# Altium schematic sheet Sheet1.SchDoc
size A3; SheetNumber: 1; SheetTotal: 1
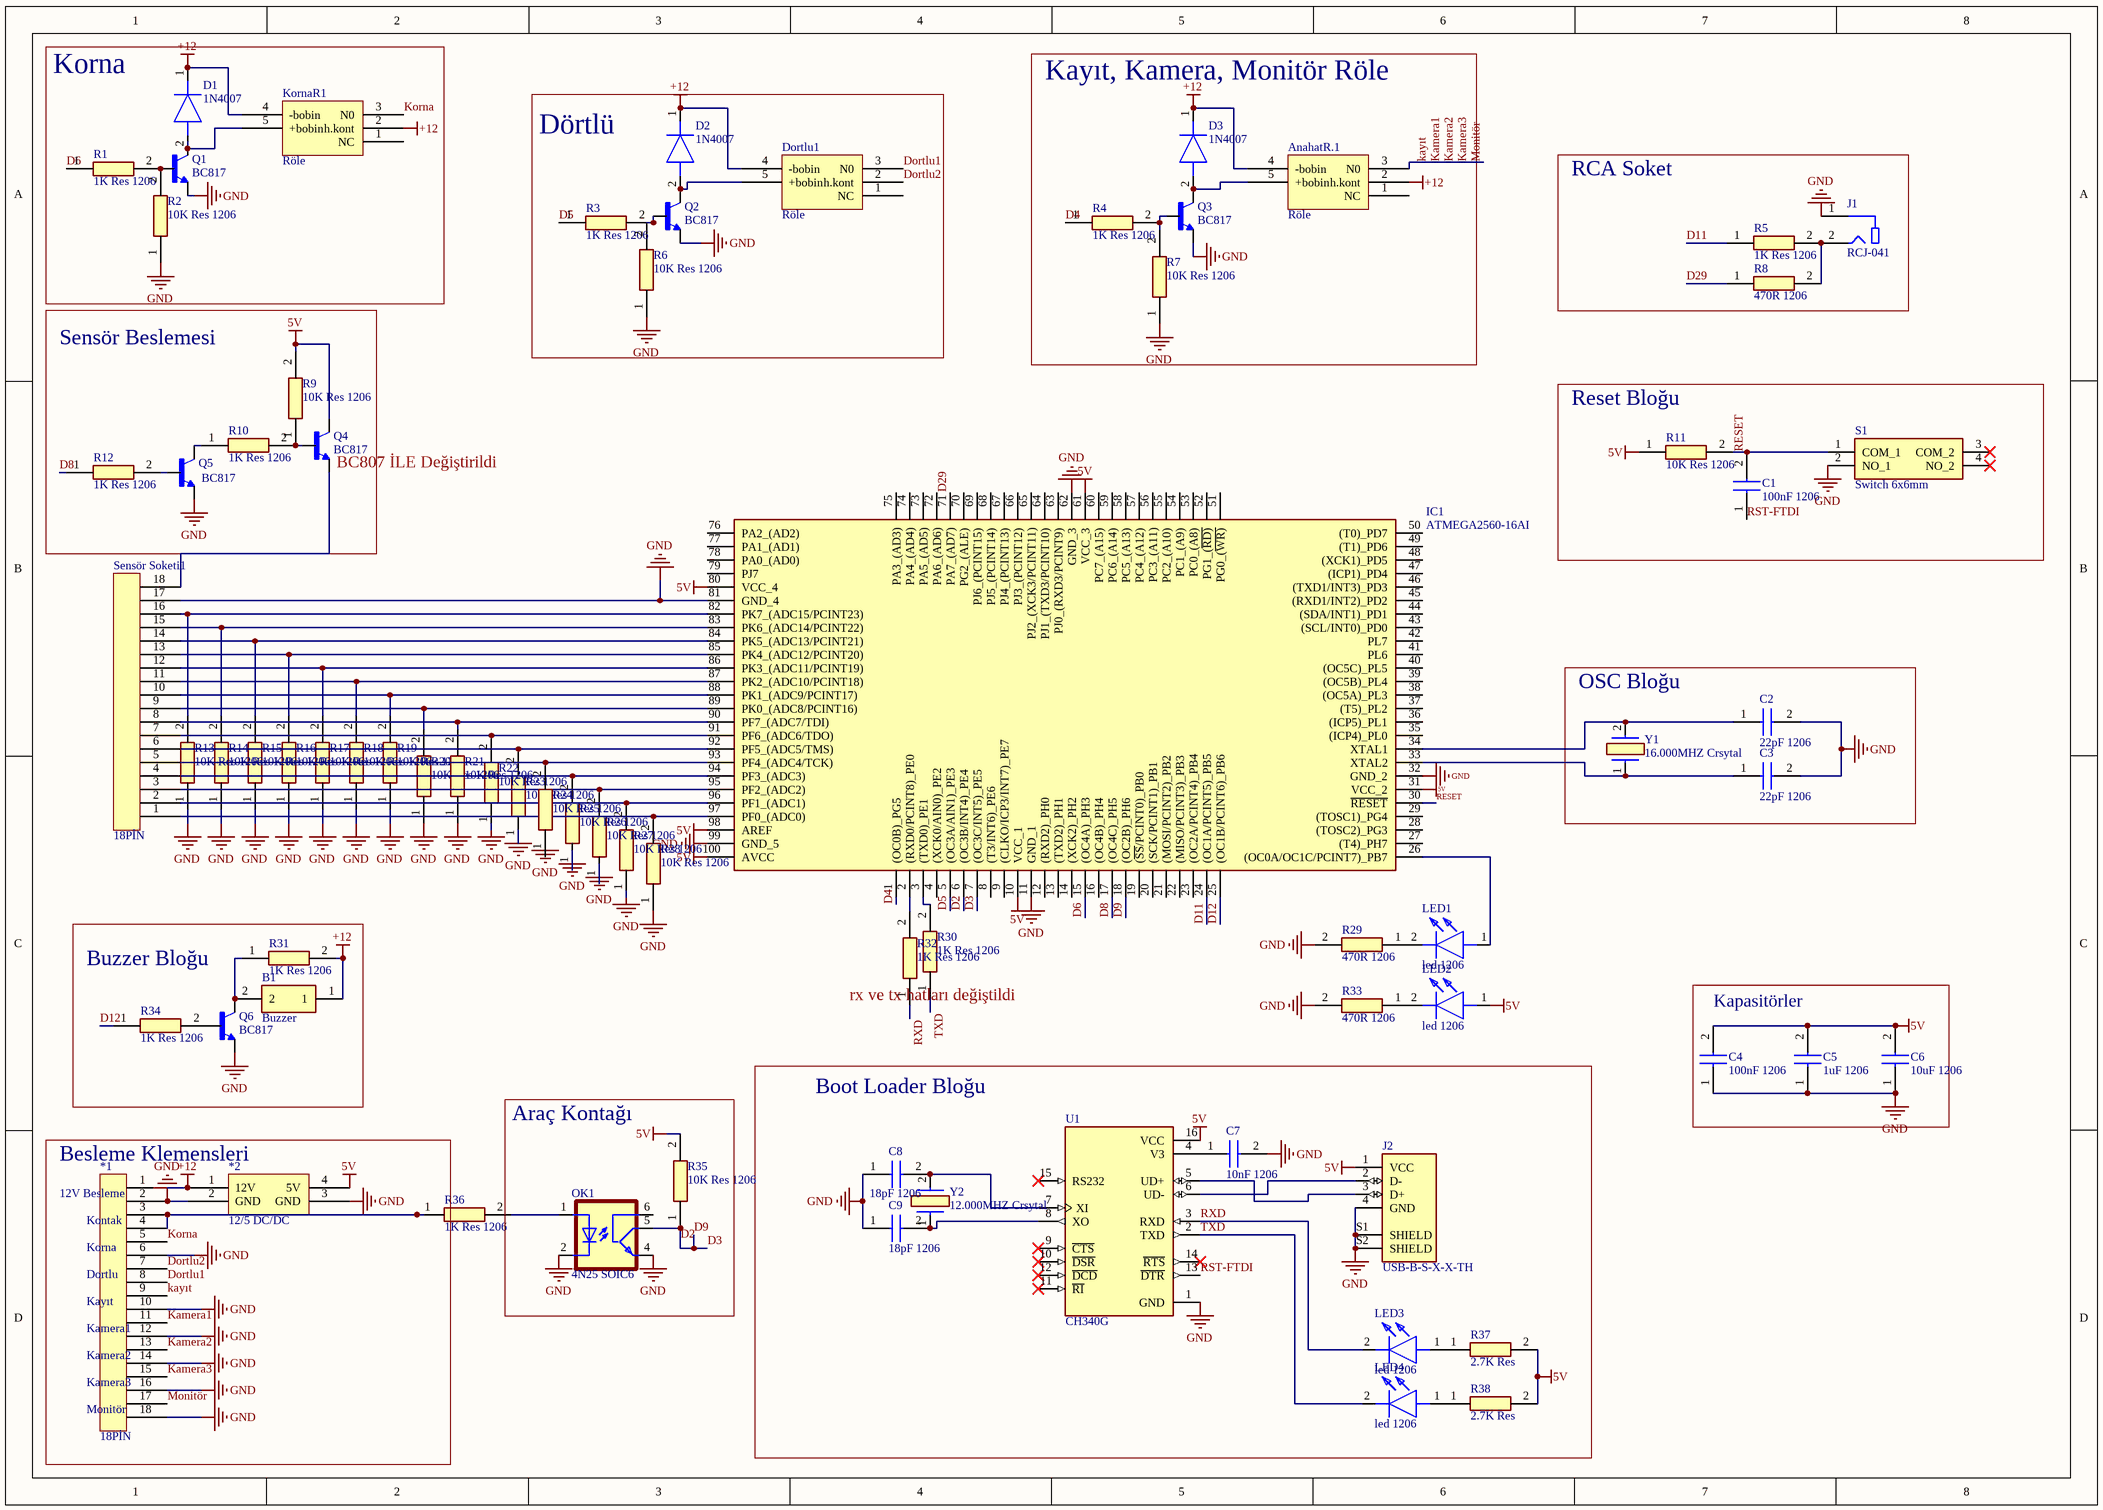
[diagram p0: Sheet1.SchDoc]

## Parts
*1  18PİN  [18x5,08]
*2  12/5 DC/DC  [12/5V DC/DC]
AnahatR.1  Röle  [Röle]
B1  Buzzer  [Buzzer]
C1  100nF 1206  [CAPC3216X95N(100nF 1206)]
C2  22pF 1206  [CAPC3216X95N(100nF 1206)]
C3  22pF 1206  [CAPC3216X95N(100nF 1206)]
C4  100nF 1206  [CAPC3216X95N(100nF 1206)]
C5  1uF 1206  [CAPC3216X95N(100nF 1206)]
C6  10uF 1206  [CAPC3216X95N(100nF 1206)]
C7  10nF 1206  [CAPC3216X95N(100nF 1206)]
C8  18pF 1206  [CAPC3216X95N(100nF 1206)]
C9  18pF 1206  [CAPC3216X95N(100nF 1206)]
D1  1N4007  [1N4007]
D2  1N4007  [1N4007]
D3  1N4007  [1N4007]
Dortlu1  Röle  [Röle]
IC1  ATMEGA2560-16AI  [QFP50P1600X1600X120-100N]
J1  RCJ-041  [RCA]
J2  USB-B-S-X-X-TH  [USB-B-S-X-X-TH]
KornaR1  Röle  [Röle]
LED1  led 1206  [led 1206]
LED2  led 1206  [led 1206]
LED3  led 1206  [led 1206]
LED4  led 1206  [led 1206]
OK1  4N25 SOIC6  [4N25 SOIC6]
Q1  BC817  [BC817 Sot23]
Q2  BC817  [BC817 Sot23]
Q3  BC817  [BC817 Sot23]
Q4  BC817  [BC817 Sot23]
Q5  BC817  [BC817 Sot23]
Q6  BC817  [BC817 Sot23]
R1  1K Res 1206  [RESC3216X60N ( 1206 )]
R2  10K Res 1206  [RESC3216X60N ( 1206 )]
R3  1K Res 1206  [RESC3216X60N ( 1206 )]
R4  1K Res 1206  [RESC3216X60N ( 1206 )]
R5  1K Res 1206  [RESC3216X60N ( 1206 )]
R6  10K Res 1206  [RESC3216X60N ( 1206 )]
R7  10K Res 1206  [RESC3216X60N ( 1206 )]
R8  470R 1206  [RESC3216X60N ( 1206 )]
R9  10K Res 1206  [RESC3216X60N ( 1206 )]
R10  1K Res 1206  [RESC3216X60N ( 1206 )]
R11  10K Res 1206  [RESC3216X60N ( 1206 )]
R12  1K Res 1206  [RESC3216X60N ( 1206 )]
R13  10K Res 1206  [RESC3216X60N ( 1206 )]
R14  10K Res 1206  [RESC3216X60N ( 1206 )]
R15  10K Res 1206  [RESC3216X60N ( 1206 )]
R16  10K Res 1206  [RESC3216X60N ( 1206 )]
R17  10K Res 1206  [RESC3216X60N ( 1206 )]
R18  10K Res 1206  [RESC3216X60N ( 1206 )]
R19  10K Res 1206  [RESC3216X60N ( 1206 )]
R20  10K Res 1206  [RESC3216X60N ( 1206 )]
R21  10K Res 1206  [RESC3216X60N ( 1206 )]
R22  10K Res 1206  [RESC3216X60N ( 1206 )]
R23  10K Res 1206  [RESC3216X60N ( 1206 )]
R24  10K Res 1206  [RESC3216X60N ( 1206 )]
R25  10K Res 1206  [RESC3216X60N ( 1206 )]
R26  10K Res 1206  [RESC3216X60N ( 1206 )]
R27  10K Res 1206  [RESC3216X60N ( 1206 )]
R28  10K Res 1206  [RESC3216X60N ( 1206 )]
R29  470R 1206  [RESC3216X60N ( 1206 )]
R30  1K Res 1206  [RESC3216X60N ( 1206 )]
R31  1K Res 1206  [RESC3216X60N ( 1206 )]
R32  1K Res 1206  [RESC3216X60N ( 1206 )]
R33  470R 1206  [RESC3216X60N ( 1206 )]
R34  1K Res 1206  [RESC3216X60N ( 1206 )]
R35  10K Res 1206  [RESC3216X60N ( 1206 )]
R36  1K Res 1206  [RESC3216X60N ( 1206 )]
R37  2.7K Res  [RESC3216X60N ( 1206 )]
R38  2.7K Res  [RESC3216X60N ( 1206 )]
S1  Switch 6x6mm  [6x6x8mm Push Buton]
Sensör_Soketi1  18PİN  [18x5,08]
U1  CH340G  [SOIC16]
Y1  16.000MHZ Crsytal  [XTAL_Dip]
Y2  12.000MHZ Crsytal  [XTAL_Dip]

## Blocks framed on the sheet
Korna: D1 KornaR1 Q1 R1 R2
Kayıt, Kamera, Monitör Röle: AnahatR.1 D3 Q3 R4 R7
Dörtlü: D2 Dortlu1 Q2 R3 R6
RCA Soket: J1 R5 R8
Sensör Beslemesi: Q4 Q5 R9 R10 R12
Reset Bloğu: C1 R11 S1
OSC Bloğu: C2 C3 Y1
Buzzer Bloğu: B1 Q6 R31 R34
Kapasitörler: C4-C6
Araç Kontağı: OK1 R35
Boot Loader Bloğu: C7-C9 J2 LED3 LED4 R37 R38 U1 Y2
Besleme Klemensleri: *1 *2

## Nets
5V: *2.4(5V) C4.2 C5.2 C6.2 IC1.10(VCC_1) IC1.31(VCC_2) IC1.61(VCC_3) IC1.80(VCC_4) IC1.98(AREF) IC1.100(AVCC) J2.1(VCC) LED2.1(A) Q4.3(C) R9.2 R11.1 R35.2 R37.2 R38.2 U1.16(VCC)
+12: *1.1 *2.1(12V) AnahatR.1.2(h.kont) AnahatR.1.4(-bobin) B1.1 D1.1(K) D2.1(K) D3.1(K) Dortlu1.4(-bobin) KornaR1.2(h.kont) KornaR1.4(-bobin) R31.2
GND: *1.2 *1.6 *1.10 *1.12 *1.14 *1.16 *1.18 *2.2(GND) *2.3(GND) C2.2 C3.2 C4.1 C5.1 C6.1 C7.2 C8.1 C9.1 IC1.11(GND_1) IC1.32(GND_2) IC1.62(GND_3) IC1.81(GND_4) IC1.99(GND_5) J1.1 J2.4(GND) J2.S1(SHIELD) J2.S2(SHIELD) OK1.2(C) OK1.4(EMI) Q1.2(E) Q2.2(E) Q3.2(E) Q5.2(E) Q6.2(E) R2.1 R6.1 R7.1 R13.1 R14.1 R15.1 R16.1 R17.1 R18.1 R19.1 R20.1 R21.1 R22.1 R23.1 R24.1 R25.1 R26.1 R27.1 R28.1 R29.2 R33.2 S1.2(NO_1) Sensör_Soketi1.17 U1.1(GND)
D2: IC1.6((OC3B/INT4)_PE4) IC1.7((OC3C/INT5)_PE5) IC1.18((OC2B)_PH6) OK1.5(COL) R35.1  [also labelled D3, D9]
D4: IC1.1((OC0B)_PG5) R4.1
D5: IC1.5((OC3A/AIN1)_PE3) R3.1
D6: IC1.15((OC4A)_PH3) R1.1
D8: IC1.17((OC4C)_PH5) R12.1
D11: IC1.24((OC1A/PCINT5)_PB5) R5.1
D12: IC1.25((OC1B/PCINT6)_PB6) R34.1
D29: IC1.71(PA7_(AD7)) R8.1
Dortlu1: *1.8 Dortlu1.3(N0)
Dortlu2: *1.7 Dortlu1.2(h.kont)
Kamera1: *1.9 *1.11 *1.13 *1.15 *1.17 AnahatR.1.3(N0)  [also labelled Kamera2, Kamera3, kayıt, Monitör]
Korna: *1.5 KornaR1.3(N0)
RESET: C1.2 IC1.30(~{RESET}) R11.2 S1.1(COM_1)
RST-FTDI: C1.1 U1.13(~{DTR})
RXD: LED3.2(K) R32.1 U1.3(RXD)
TXD: LED4.2(K) R30.1 U1.2(TXD)
Net*1_3: *1.3 *1.4 R36.1
NetAnahatR.1_5: AnahatR.1.5(+bobin) D3.2(A) Q3.3(C)
NetB1_2: B1.2 Q6.3(C) R31.1
NetC2_1: C2.1 IC1.34(XTAL1) Y1.2
NetC3_1: C3.1 IC1.33(XTAL2) Y1.1
NetC7_1: C7.1 U1.4(V3)
NetC8_2: C8.2 U1.7(XI) Y2.2
NetC9_2: C9.2 U1.8(XO) Y2.1
NetD1_2: D1.2(A) KornaR1.5(+bobin) Q1.3(C)
NetD2_2: D2.2(A) Dortlu1.5(+bobin) Q2.3(C)
NetIC1_2: IC1.2((RXD0/PCINT8)_PE0) R32.2
NetIC1_3: IC1.3((TXD0)_PE1) R30.2
NetIC1_26: IC1.26((OC0A/OC1C/PCINT7)_PB7) LED1.1(A)
NetIC1_82: IC1.82(PK7_(ADC15/PCINT23)) R13.2 Sensör_Soketi1.16
NetIC1_83: IC1.83(PK6_(ADC14/PCINT22)) R14.2 Sensör_Soketi1.15
NetIC1_84: IC1.84(PK5_(ADC13/PCINT21)) R15.2 Sensör_Soketi1.14
NetIC1_85: IC1.85(PK4_(ADC12/PCINT20)) R16.2 Sensör_Soketi1.13
NetIC1_86: IC1.86(PK3_(ADC11/PCINT19)) R17.2 Sensör_Soketi1.12
NetIC1_87: IC1.87(PK2_(ADC10/PCINT18)) R18.2 Sensör_Soketi1.11
NetIC1_88: IC1.88(PK1_(ADC9/PCINT17)) R19.2 Sensör_Soketi1.10
NetIC1_89: IC1.89(PK0_(ADC8/PCINT16)) R20.2 Sensör_Soketi1.9
NetIC1_90: IC1.90(PF7_(ADC7/TDI)) R21.2 Sensör_Soketi1.8
NetIC1_91: IC1.91(PF6_(ADC6/TDO)) R22.2 Sensör_Soketi1.7
NetIC1_92: IC1.92(PF5_(ADC5/TMS)) R23.2 Sensör_Soketi1.6
NetIC1_93: IC1.93(PF4_(ADC4/TCK)) R24.2 Sensör_Soketi1.5
NetIC1_94: IC1.94(PF3_(ADC3)) R25.2 Sensör_Soketi1.4
NetIC1_95: IC1.95(PF2_(ADC2)) R26.2 Sensör_Soketi1.3
NetIC1_96: IC1.96(PF1_(ADC1)) R27.2 Sensör_Soketi1.2
NetIC1_97: IC1.97(PF0_(ADC0)) R28.2 Sensör_Soketi1.1
NetJ1_2: J1.2 R5.2 R8.2
NetJ2_2: J2.2(D-) U1.6(UD-)
NetJ2_3: J2.3(D+) U1.5(UD+)
NetLED1_2: LED1.2(K) R29.1
NetLED2_2: LED2.2(K) R33.1
NetLED3_1: LED3.1(A) R37.1
NetLED4_1: LED4.1(A) R38.1
NetOK1_1: OK1.1(A) R36.2
NetQ1_1: Q1.1(B) R1.2 R2.2
NetQ2_1: Q2.1(B) R3.2 R6.2
NetQ3_1: Q3.1(B) R4.2 R7.2
NetQ4_1: Q4.1(B) R9.1 R10.2
NetQ4_2: Q4.2(E) Sensör_Soketi1.18
NetQ5_1: Q5.1(B) R12.2
NetQ5_3: Q5.3(C) R10.1
NetQ6_1: Q6.1(B) R34.2

Not connected (* = marked no-connect by the designer): AnahatR.1 1(NC); Dortlu1 1(NC); IC1 4((XCK0/AIN0)_PE2) 8((T3/INT6)_PE6) 9((CLKO/ICP3/INT7)_PE7) 12((RXD2)_PH0) 13((TXD2)_PH1) 14((XCK2)_PH2) 16((OC4B)_PH4) 19((~{SS}/PCINT0)_PB0) 20((SCK/PCINT1)_PB1) 21((MOSI/PCINT2)_PB2) 22((MISO/PCINT3)_PB3) 23((OC2A/PCINT4)_PB4) 27((T4)_PH7) 28((TOSC2)_PG3) 29((TOSC1)_PG4) 35((ICP4)_PL0) 36((ICP5)_PL1) 37((T5)_PL2) 38((OC5A)_PL3) 39((OC5B)_PL4) 40((OC5C)_PL5) 41(PL6) 42(PL7) 43((SCL/INT0)_PD0) 44((SDA/INT1)_PD1) 45((RXD1/INT2)_PD2) 46((TXD1/INT3)_PD3) 47((ICP1)_PD4) 48((XCK1)_PD5) 49((T1)_PD6) 50((T0)_PD7) 51(PG0_(~{WR)}) 52(PG1_(~{RD)}) 53(PC0_(A8)) 54(PC1_(A9)) 55(PC2_(A10)) 56(PC3_(A11)) 57(PC4_(A12)) 58(PC5_(A13)) 59(PC6_(A14)) 60(PC7_(A15)) 63(PJ0_(RXD3/PCINT9)) 64(PJ1_(TXD3/PCINT10)) 65(PJ2_(XCK3/PCINT11)) 66(PJ3_(PCINT12)) 67(PJ4_(PCINT13)) 68(PJ5_(PCINT14)) 69(PJ6_(PCINT15)) 70(PG2_(ALE)) 72(PA6_(AD6)) 73(PA5_(AD5)) 74(PA4_(AD4)) 75(PA3_(AD3)) 76(PA2_(AD2)) 77(PA1_(AD1)) 78(PA0_(AD0)) 79(PJ7); KornaR1 1(NC); OK1 6(BAS); S1 3(COM_2)* 4(NO_2)*; U1 9(~{CTS})* 10(~{DSR})* 11(~{RI})* 12(~{DCD})* 14(~{RTS})* 15(RS232)*

## Notes on the sheet
- (near Q4) BC807 İLE Değiştirildi
- rx ve tx hatları değiştildi
- (near *1) 12V Besleme
- (near *1) Kontak
- (near *1) Korna
- (near *1) Dortlu
- (near *1) Kayıt
- (near *1) Kamera1
- (near *1) Kamera2
- (near *1) Kamera3
- (near *1) Monitör

## Library data of the parts
B1 = Buzzer: TERMINAL BLOCK,HEADER, 5.08 MM, 2WAY; Product Range:-; Gender:Header; MF: TE Connectivity; MP: 282814-2; EU_RoHS_Compliance: Compliant; SnapEDA_Link: https://www.snapeda.com/parts/282814-2/TE%20Connectivity%20AMP%20Connectors/view-part/2381383/?ref=snap; Availability: Unavailable; Price: None; Package: None; TE_purchase_URL: https://www.te.com/usa-en/product-282814-2.html?te_bu=Cor&te_type=disp&te_campaign=seda_glo_cor-seda-global-disp-prtnr-fy19-seda-model-bom-cta_sma-317_1&elqCampaignId=32493; Value: *
C1 C4 = 100nF 1206: Capacitor; Manufacturer_Name: Murata Electronics; Manufacturer_Part_Number: GRM319F51H104ZA01D; Datasheet Link: https://datasheet.datasheetarchive.com/originals/distributors/Datasheets-DGA9/2502990.pdf; Height: 0.95mm; Mouser Part Number: 81-GRM319F51H104ZA; Mouser Price/Stock: https://www.mouser.com/Search/Refine.aspx?Keyword=81-GRM319F51H104ZA; Arrow Part Number: GRM319F51H104ZA01D; Arrow Price/Stock: https://www.arrow.com/en/products/grm319f51h104za01d/murata-manufacturing
C2 C3 = 22pF 1206: Capacitor; Manufacturer_Name: Murata Electronics; Manufacturer_Part_Number: GRM319F51H104ZA01D; Datasheet Link: https://datasheet.datasheetarchive.com/originals/distributors/Datasheets-DGA9/2502990.pdf; Height: 0.95mm; Mouser Part Number: 81-GRM319F51H104ZA; Mouser Price/Stock: https://www.mouser.com/Search/Refine.aspx?Keyword=81-GRM319F51H104ZA; Arrow Part Number: GRM319F51H104ZA01D; Arrow Price/Stock: https://www.arrow.com/en/products/grm319f51h104za01d/murata-manufacturing
C5 = 1uF 1206: Capacitor; Manufacturer_Name: Murata Electronics; Manufacturer_Part_Number: GRM319F51H104ZA01D; Datasheet Link: https://datasheet.datasheetarchive.com/originals/distributors/Datasheets-DGA9/2502990.pdf; Height: 0.95mm; Mouser Part Number: 81-GRM319F51H104ZA; Mouser Price/Stock: https://www.mouser.com/Search/Refine.aspx?Keyword=81-GRM319F51H104ZA; Arrow Part Number: GRM319F51H104ZA01D; Arrow Price/Stock: https://www.arrow.com/en/products/grm319f51h104za01d/murata-manufacturing
C6 = 10uF 1206: Capacitor; Manufacturer_Name: Murata Electronics; Manufacturer_Part_Number: GRM319F51H104ZA01D; Datasheet Link: https://datasheet.datasheetarchive.com/originals/distributors/Datasheets-DGA9/2502990.pdf; Height: 0.95mm; Mouser Part Number: 81-GRM319F51H104ZA; Mouser Price/Stock: https://www.mouser.com/Search/Refine.aspx?Keyword=81-GRM319F51H104ZA; Arrow Part Number: GRM319F51H104ZA01D; Arrow Price/Stock: https://www.arrow.com/en/products/grm319f51h104za01d/murata-manufacturing
C7 = 10nF 1206: Capacitor; Manufacturer_Name: Murata Electronics; Manufacturer_Part_Number: GRM319F51H104ZA01D; Datasheet Link: https://datasheet.datasheetarchive.com/originals/distributors/Datasheets-DGA9/2502990.pdf; Height: 0.95mm; Mouser Part Number: 81-GRM319F51H104ZA; Mouser Price/Stock: https://www.mouser.com/Search/Refine.aspx?Keyword=81-GRM319F51H104ZA; Arrow Part Number: GRM319F51H104ZA01D; Arrow Price/Stock: https://www.arrow.com/en/products/grm319f51h104za01d/murata-manufacturing
C8 C9 = 18pF 1206: Capacitor; Manufacturer_Name: Murata Electronics; Manufacturer_Part_Number: GRM319F51H104ZA01D; Datasheet Link: https://datasheet.datasheetarchive.com/originals/distributors/Datasheets-DGA9/2502990.pdf; Height: 0.95mm; Mouser Part Number: 81-GRM319F51H104ZA; Mouser Price/Stock: https://www.mouser.com/Search/Refine.aspx?Keyword=81-GRM319F51H104ZA; Arrow Part Number: GRM319F51H104ZA01D; Arrow Price/Stock: https://www.arrow.com/en/products/grm319f51h104za01d/murata-manufacturing
D1-D3 = 1N4007: Diode; Manufacturer_Name: ROHM Semiconductor; Manufacturer_Part_Number: 1SS400SMT2R; Datasheet Link: https://datasheet.datasheetarchive.com/originals/distributors/Datasheets_SAMA/1cee01b15380e4b4ee81d9987647e9be.pdf; Height: 0.7mm; Mouser Part Number: 755-1SS400SMT2R; Mouser Price/Stock: https://www.mouser.co.uk/ProductDetail/ROHM-Semiconductor/1SS400SMT2R?qs=QcFhgjUTvvq%2Fjg4ayY%252BmJw%3D%3D; Arrow Part Number: 1SS400SMT2R; Arrow Price/Stock: https://www.arrow.com/en/products/1ss400smt2r/rohm-semiconductor
IC1 = ATMEGA2560-16AI: Integrated Circuit; Manufacturer_Name: Microchip; Datasheet Link: https://www.datasheet5.com/part/ATMEGA2560-16AI/Atmel%20Corporation#pdf-wrapper; Height: 1.2mm; Manufacturer_Part_Number: ATMEGA2560-16AI; Mouser Part Number: 556-ATMEGA2560-16AI; Mouser Price/Stock: https://www.mouser.co.uk/ProductDetail/Microchip-Technology-Atmel/ATMEGA2560-16AI?qs=b1J4i6otjZtlyidGHqdxdQ%3D%3D
J1 = RCJ-041: Metal Right-Angle, RCA Jack, Black Housing and Insulation; MF: CUI Devices; Price: None; MP: RCJ-041; Package: None; Value: *; Availability: Unavailable; SnapEDA_Link: https://www.snapeda.com/parts/RCJ-041/CUI%20Devices/view-part/2873310/?ref=snap
J2 = USB-B-S-X-X-TH: USB-B (USB TYPE-B) USB 2.0 Receptacle Connector 4 Position Through Hole, Right Angle; Package: None; Price: None; Availability: Unavailable; MP: USB-B-S-X-X-TH; Value: *
LED1-LED4 = led 1206: LED; Manufacturer_Name: Wurth Elektronik; Manufacturer_Part_Number: 15412085A9000; Datasheet Link: https://www.we-online.com/catalog/datasheet/15412085A9000.pdf; Height: 1.21mm; Mouser Part Number: 710-15412085A9000; Mouser Price/Stock: https://www.mouser.co.uk/ProductDetail/Wurth-Elektronik/15412085A9000?qs=u16ybLDytRakpVDTKYCvNw%3D%3D
OK1 = 4N25 SOIC6: Optoisolator Transistor with Base Output 4170Vrms 1 Channel 6-SMD; MP: 4N25SM; MF: ON Semiconductor; Availability: Unavailable; SnapEDA_Link: https://www.snapeda.com/parts/4N25SM/ON%20Semiconductor/view-part/2630074/?ref=snap; Package: SMD-6 ON Semiconductor; Value: *; Price: None
Q1-Q6 = BC817: Bipolar _BJT_ Transistor NPN 45V 500mA 100MHz 300mW Surface Mount SOT-23-3 _TO-236_; MF: Nexperia USA; Availability: Unavailable; Package: SOT-23-3 Rectron; Price: None; SnapEDA_Link: https://www.snapeda.com/parts/BC817/Nexperia%20USA%20Inc./view-part/4219270/?ref=snap; Value: *; MP: BC817
R1 R3-R5 R10 R12 R30-R32 R34 R36 = 1K Res 1206: Resistor; Manufacturer_Name: Vishay; Manufacturer_Part_Number: CRCW120610K0DHEAP; Datasheet Link: http://componentsearchengine.com/Datasheets/1/CRCW120610K0DHEAP.pdf; Height: 0.6mm; Mouser Part Number: 71-CRCW120610K0DHEAP; Mouser Price/Stock: https://www.mouser.co.uk/ProductDetail/Vishay-Dale/CRCW120610K0DHEAP?qs=4BdzfeD6%252Bt0oQlLvLz8F%2Fg%3D%3D; Arrow Part Number: CRCW120610K0DHEAP; Arrow Price/Stock: https://www.arrow.com/en/products/crcw120610k0dheap/vishay
R2 R6 R7 R9 R11 R13-R28 R35 = 10K Res 1206: Resistor; Manufacturer_Name: Vishay; Manufacturer_Part_Number: CRCW120610K0DHEAP; Datasheet Link: http://componentsearchengine.com/Datasheets/1/CRCW120610K0DHEAP.pdf; Height: 0.6mm; Mouser Part Number: 71-CRCW120610K0DHEAP; Mouser Price/Stock: https://www.mouser.co.uk/ProductDetail/Vishay-Dale/CRCW120610K0DHEAP?qs=4BdzfeD6%252Bt0oQlLvLz8F%2Fg%3D%3D; Arrow Part Number: CRCW120610K0DHEAP; Arrow Price/Stock: https://www.arrow.com/en/products/crcw120610k0dheap/vishay
R8 R29 R33 = 470R 1206: Resistor; Manufacturer_Name: Vishay; Manufacturer_Part_Number: CRCW120610K0DHEAP; Datasheet Link: http://componentsearchengine.com/Datasheets/1/CRCW120610K0DHEAP.pdf; Height: 0.6mm; Mouser Part Number: 71-CRCW120610K0DHEAP; Mouser Price/Stock: https://www.mouser.co.uk/ProductDetail/Vishay-Dale/CRCW120610K0DHEAP?qs=4BdzfeD6%252Bt0oQlLvLz8F%2Fg%3D%3D; Arrow Part Number: CRCW120610K0DHEAP; Arrow Price/Stock: https://www.arrow.com/en/products/crcw120610k0dheap/vishay
R37 R38 = 2.7K Res: Resistor; Manufacturer_Name: Vishay; Manufacturer_Part_Number: CRCW120610K0DHEAP; Datasheet Link: http://componentsearchengine.com/Datasheets/1/CRCW120610K0DHEAP.pdf; Height: 0.6mm; Mouser Part Number: 71-CRCW120610K0DHEAP; Mouser Price/Stock: https://www.mouser.co.uk/ProductDetail/Vishay-Dale/CRCW120610K0DHEAP?qs=4BdzfeD6%252Bt0oQlLvLz8F%2Fg%3D%3D; Arrow Part Number: CRCW120610K0DHEAP; Arrow Price/Stock: https://www.arrow.com/en/products/crcw120610k0dheap/vishay
S1 = Switch 6x6mm: Switch; Manufacturer_Name: Wurth Elektronik; Manufacturer_Part_Number: 430182070816; Datasheet Link: https://datasheet.datasheetarchive.com/originals/distributors/DKDS-9/165015.pdf; Height: 7.15mm; Mouser Part Number: 710-430182070816; Mouser Price/Stock: https://www.mouser.co.uk/ProductDetail/Wurth-Elektronik/430182070816?qs=wr8lucFkNMXtq9RwGFkUbg%3D%3D
Y1 = 16.000MHZ Crsytal: Crystal or Oscillator; Manufacturer_Name: ABRACON; Manufacturer_Part_Number: ABLS2-16.000MHZ-D4Y-T; Datasheet Link: https://abracon.com/Resonators/ABLS2.pdf; Mouser Part Number: 815-ABLS2-16-D4Y-T; Mouser Price/Stock: https://www.mouser.co.uk/ProductDetail/ABRACON/ABLS2-16.000MHZ-D4Y-T?qs=LoTOQoUkC8S5C2377M50iA%3D%3D; Arrow Part Number: ABLS2-16.000MHZ-D4Y-T; Arrow Price/Stock: https://www.arrow.com/en/products/abls2-16.000mhz-d4y-t/abracon?region=nac
Y2 = 12.000MHZ Crsytal: Crystal or Oscillator; Manufacturer_Name: ABRACON; Manufacturer_Part_Number: ABLS2-16.000MHZ-D4Y-T; Datasheet Link: https://abracon.com/Resonators/ABLS2.pdf; Mouser Part Number: 815-ABLS2-16-D4Y-T; Mouser Price/Stock: https://www.mouser.co.uk/ProductDetail/ABRACON/ABLS2-16.000MHZ-D4Y-T?qs=LoTOQoUkC8S5C2377M50iA%3D%3D; Arrow Part Number: ABLS2-16.000MHZ-D4Y-T; Arrow Price/Stock: https://www.arrow.com/en/products/abls2-16.000mhz-d4y-t/abracon?region=nac
U1 = CH340G: Value: *; MP: CH340G; Package: None; Availability: Unavailable; Price: None